# EAGLE design control_AX12 (EAGLE 6.1)
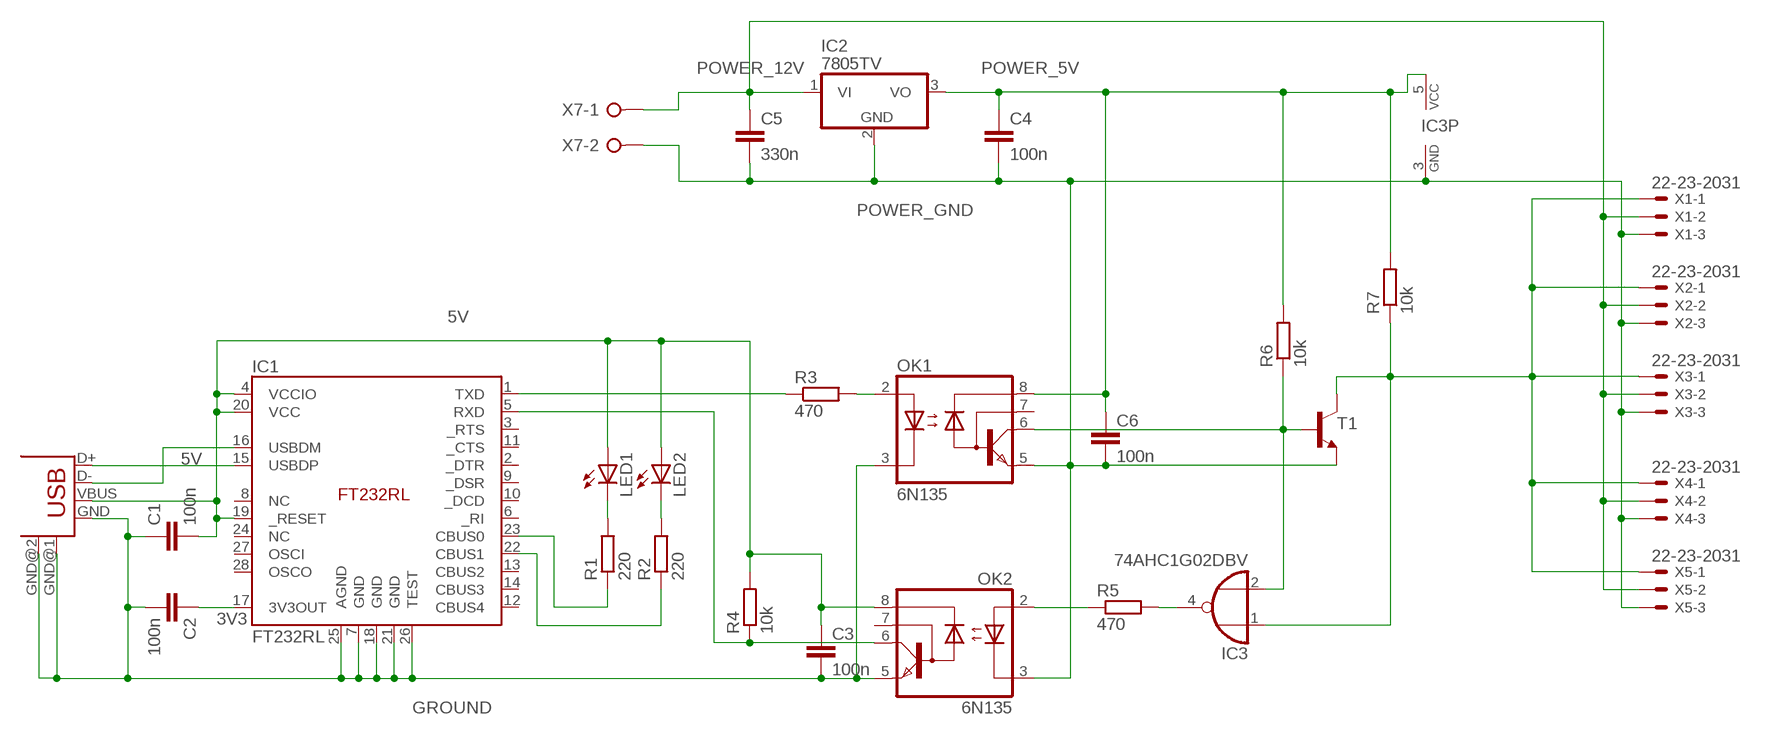
[diagram p0: schematic, sheet 1]

## Parts
C1  100n  C-EUC0805  [C0805]
C2  100n  C-EUC0805  [C0805]
C3  100n  C-EUC0805  [C0805]
C4  100n  C-EUC0805  [C0805]
C5  330n  C-EUC0805  [C0805]
C6  100n  C-EUC0805  [C0805]
IC1  FT232RL  [SSOP-28]
IC2  7805TV  [TO220V]
IC3  74AHC1G02DBV  [SOT23-5]
LED1  LED5MM  [LED5MM]
LED2  LED5MM  [LED5MM]
OK1  6N135  [DIL08]
OK2  6N135  [DIL08]
R1  220  R-EU_M0805  [M0805]
R2  220  R-EU_M0805  [M0805]
R3  470  R-EU_0207/10  [0207/10]
R4  10k  R-EU_0207/10  [0207/10]
R5  470  R-EU_0207/10  [0207/10]
R6  10k  R-EU_0207/10  [0207/10]
R7  10k  R-EU_0207/10  [0207/10]
T1  BC547-NPN-TO92-CBE  [TO92-CBE]
USB1  USB-B-H  [USB-B-H]
X1  22-23-2031  [22-23-2031]
X2  22-23-2031  [22-23-2031]
X3  22-23-2031  [22-23-2031]
X4  22-23-2031  [22-23-2031]
X5  22-23-2031  [22-23-2031]
X7  W237-02P  [W237-132]

## Nets
3V3: C2.1 IC1.17(3V3OUT)
5V: C1.2 C3.1 IC1.4(VCCIO) IC1.19(_RESET) IC1.20(VCC) LED1.A LED2.A OK2.8(VCC) R4.2 USB1.VBUS
GROUND: C1.1 C2.2 C3.2 IC1.7(GND) IC1.18(GND) IC1.21(GND) IC1.25(AGND) IC1.26(TEST) OK1.3(C) OK2.5(GND) USB1.GND USB1.GND@1(GND) USB1.GND@2(GND)
N$5: IC1.22(CBUS1) R2.1
N$6: IC1.1(TXD) R3.1
N$7: IC1.5(RXD) OK2.6(VO) R4.1
N$8: IC1.23(CBUS0) R1.1
N$9: LED1.K(C) R1.2
N$10: LED2.K(C) R2.2
N$20: OK1.2(A) R3.2
N$33: IC1.16(USBDM) USB1.D-
N$42: IC1.15(USBDP) USB1.D+
N$43: OK2.2(A) R5.1
N$44: IC3.4(O) R5.2
N$46: IC3.2(I1) OK1.6(VO) R6.1 T1.B
N$49: IC3.1(I0) R7.1 T1.C X1.1 X2.1 X3.1 X4.1 X5.1
POWER_5V: C4.1 C6.1 IC2.3(VO) IC3.5(VCC) OK1.8(VCC) R6.2 R7.2
POWER_12V: C5.1 IC2.1(VI) X1.2 X2.2 X3.2 X4.2 X5.2 X7.1
POWER_GND: C4.2 C5.2 C6.2 IC2.2(GND) IC3.3(GND) OK1.5(GND) OK2.3(C) T1.E X1.3 X2.3 X3.3 X4.3 X5.3 X7.2
Unconnected: IC1.2(_DTR) IC1.3(_RTS) IC1.6(_RI) IC1.8(NC) IC1.9(_DSR) IC1.10(_DCD) IC1.11(_CTS) IC1.12(CBUS4) IC1.13(CBUS2) IC1.14(CBUS3) IC1.24(NC) IC1.27(OSCI) IC1.28(OSCO) OK1.7(VB) OK2.7(VB)

## Library data of the parts
C1-C6 = rcl:C-EU: CAPACITOR, European symbol
IC1 = ftdi4:FT232RL
IC2 = linear:78*: Positive VOLTAGE REGULATOR Source: http://cache.national.com/ds/LM/LM78L05.pdf http://www.fairchildsemi.com/ds/LM/LM7805.pdf
IC3 = 74xx-little-de:74*1G02: 2-input NOR gate
LED1 LED2 = led:LED: LED OSRAM: - CHIPLED LG R971, LG N971, LY N971, LG Q971, LY Q971, LO R971, LY R971 LH N974, LH R974 LS Q976, LO Q976, LY Q976 LO Q996 - Hyper CHIPLED LW Q18S LB Q993, LB Q99A, LB R99A - SideLED LS A670, LO A670, LY A670, LG A670, LP A670 LB A673, LV A673, LT A673, LW A673 LH A674 LY A675 LS A676, LA A676, LO A676, LY A676, LW A676 LS A679, LY A679, LG A679 - Hyper Micro SIDELED® LS Y876, LA Y876, LO Y876, LY Y876 LT Y87S - SmartLED LW L88C, LW L88S LB L89C, LB L89S, LG L890 LS L89K, LO L89K, LY L89K LS L896, LA L896, LO L896, LY L896 - TOPLED LS T670, LO T670, LY T670, LG T670, LP T670 LSG T670, LSP T670, LSY T670, LOP T670, LYG T670 LG T671, LOG T671, LSG T671 LB T673, LV T673, LT T673, LW T673 LH T674 LS T676, LA T676, LO T676, LY T676, LB T676, LH T676, LSB T676, LW T676 LB T67C, LV T67C, LT T67C, LS T67K, LO T67K, LY T67K, LW E67C LS E67B, LA E67B, LO E67B, LY E67B, LB E67C, LV E67C, LT E67C LW T67C LS T679, LY T679, LG T679 LS T770, LO T770, LY T770, LG T770, LP T770 LB T773, LV T773, LT T773, LW T773 LH T774 LS E675, LA E675, LY E675, LS T675 LS T776, LA T776, LO T776, LY T776, LB T776 LHGB T686 LT T68C, LB T68C - Hyper Mini TOPLED® LB M676 - Mini TOPLED Santana® LG M470 LS M47K, LO M47K, LY M47K Source: http://www.osram.convergy.de LUXEON: - LUMILED® LXK2-PW12-R00, LXK2-PW12-S00, LXK2-PW14-U00, LXK2-PW14-V00 LXK2-PM12-R00, LXK2-PM12-S00, LXK2-PM14-U00 LXK2-PE12-Q00, LXK2-PE12-R00, LXK2-PE12-S00, LXK2-PE14-T00, LXK2-PE14-U00 LXK2-PB12-K00, LXK2-PB12-L00, LXK2-PB12-M00, LXK2-PB14-N00, LXK2-PB14-P00, LXK2-PB14-Q00 LXK2-PR12-L00, LXK2-PR12-M00, LXK2-PR14-Q00, LXK2-PR14-R00 LXK2-PD12-Q00, LXK2-PD12-R00, LXK2-PD12-S00 LXK2-PH12-R00, LXK2-PH12-S00 LXK2-PL12-P00, LXK2-PL12-Q00, LXK2-PL12-R00 Source: www.luxeon.com KINGBRIGHT: KA-3528ASYC Source: www.kingbright.com
OK1 OK2 = optocoupler:6N135: MOTOROLA OPTO COUPLER; MF: FAIRCHILD SEMICONDUCTOR; MPN: 6N135; OC_FARNELL: 1021342; OC_NEWARK: 58K9658
R1 R2 = resistor:R-EU_: RESISTOR, European symbol
R3-R7 = rcl:R-EU_: RESISTOR, European symbol
T1 = transistor:*-NPN-: NPN Transistror BF959 corrected 2008.03.06
USB1 = con-usb-2:USB: USB Connectors
X1-X5 = con-molex:22-23-2031: .100" (2.54mm) Center Header - 3 Pin; MF: MOLEX; MPN: 22-23-2031; OC_FARNELL: 1462950; OC_NEWARK: 30C0862
X7 = con-wago-508:W237-02P: WAGO SREW CLAMP; OC_FARNELL: unknown; OC_NEWARK: unknown

## Board
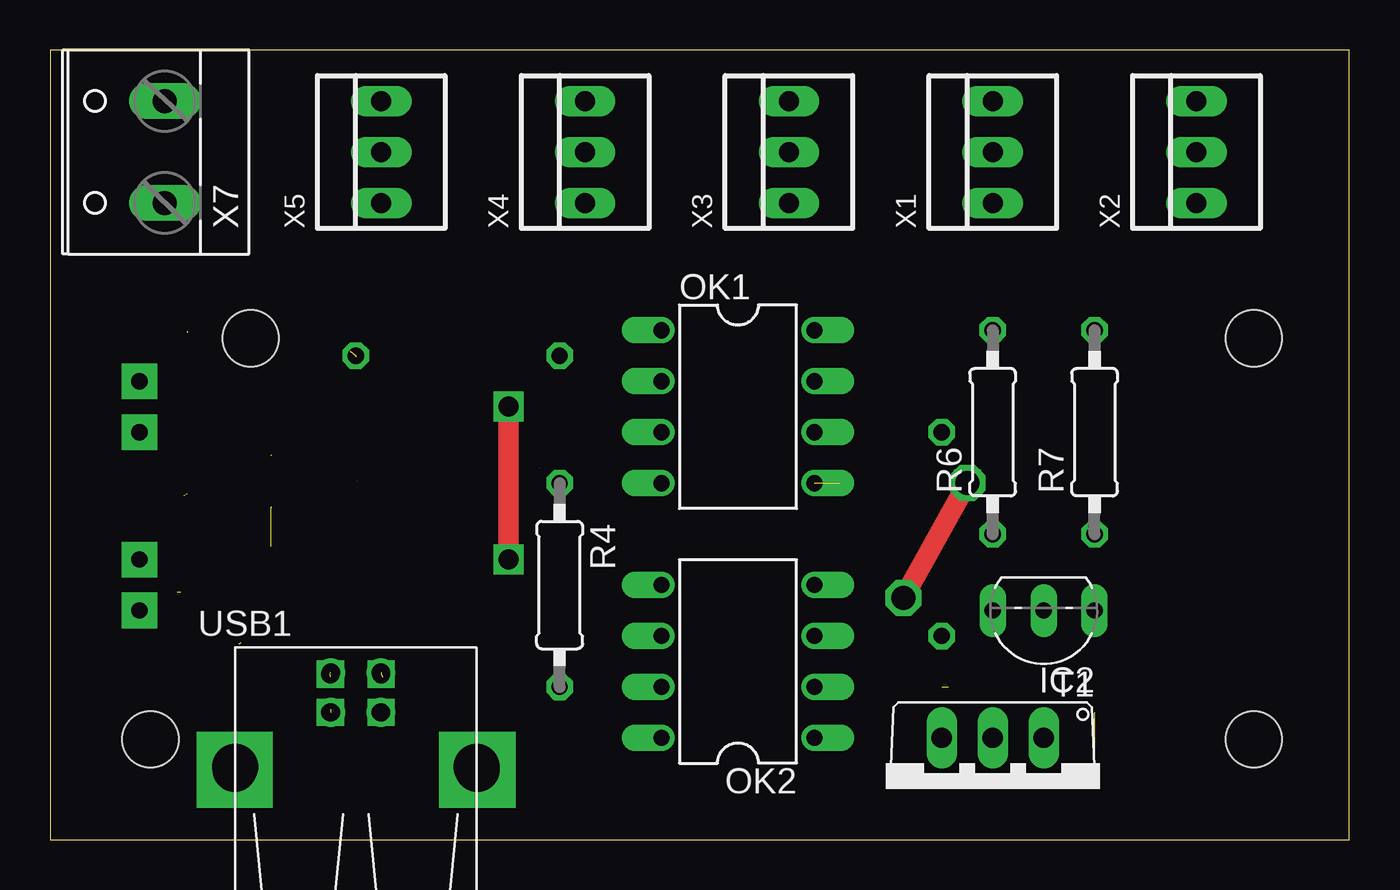
[diagram p1: board, top side]
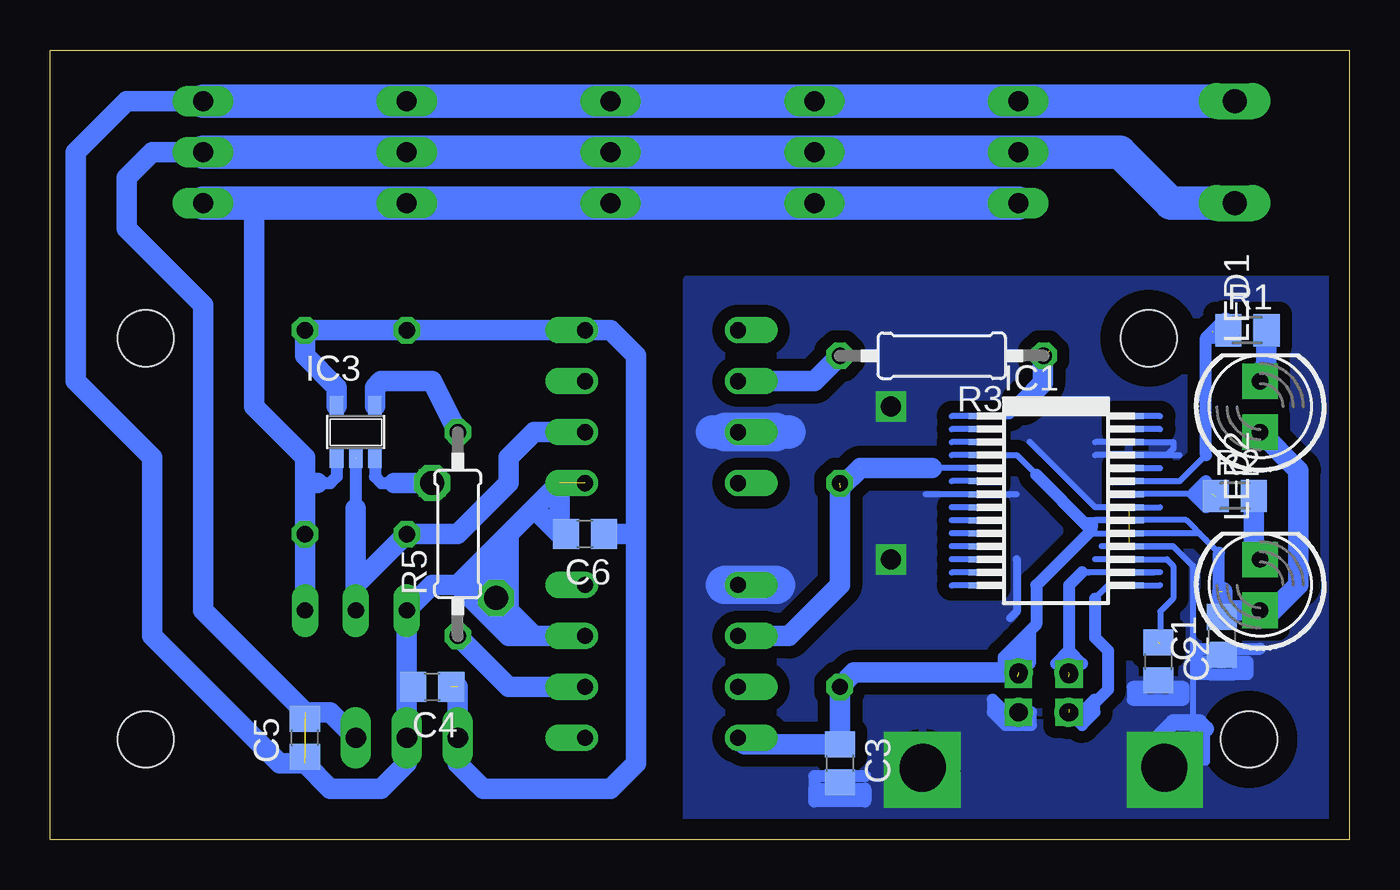
[diagram p2: board, bottom side, seen from below]

Size 64.77 x 39.37 mm. Coordinates in mm from the lower left corner, seen from the top.
Outline: 0,0 64.77,0 64.77,39.37 0,39.37 0,0
Copper layers (1*16): Top 0.035mm / dielectric 1.5mm / Bottom 0.035mm
Design rules: minimum track width 10mil, minimum drill 24mil, track to track 8mil, track to pad 8mil, pad to pad 8mil, via to via 8mil, smd to smd 8mil, copper to edge 40mil, drill to drill 8mil, minimum pad ring 10mil, minimum via ring 8mil, stop-mask expansion 4mil, vias tented up to drill 0mil, thermal gap 10mil
Holes 2.8 mm at 5,5 60,5 60,25 10,25

### Footprints (pad centres in the part's own frame; a part is rotated, then mirrored left to right if it is on the bottom)
C0805 = smd 1.3 x 1.5: 1 -0.95,0; 2 0.95,0
SSOP-28 = smd 0.3 x 1.5: 1 -4.225,-3.625; 2 -3.575,-3.625; 3 -2.925,-3.625; 4 -2.275,-3.625; 5 -1.625,-3.625; 6 -0.975,-3.625; 7 -0.325,-3.625; 8 0.325,-3.625; 9 0.975,-3.625; 10 1.625,-3.625; 11 2.275,-3.625; 12 2.925,-3.625; 13 3.575,-3.625; 14 4.225,-3.625; 15 4.225,3.625; 16 3.575,3.625; 17 2.925,3.625; 18 2.275,3.625; 19 1.625,3.625; 20 0.975,3.625; 21 0.325,3.625; 22 -0.325,3.625; 23 -0.975,3.625; 24 -1.625,3.625; 25 -2.275,3.625; 26 -2.925,3.625; 27 -3.575,3.625; 28 -4.225,3.625
TO220V = drill 1.016 long: 1 -2.54,-2.54; 2 0,-2.54; 3 2.54,-2.54
SOT23-5 = smd 0.69 x 0.99: 1 -0.95,-1.29; 2 0,-1.29; 3 0.95,-1.29; 4 0.95,1.3; 5 -0.95,1.3
LED5MM = drill 0.813 octagon: A -1.27,0; K 1.27,0
DIL08 = drill 0.813 offset: 1 -3.81,-3.81; 2 -1.27,-3.81; 3 1.27,-3.81; 4 3.81,-3.81; 5 3.81,3.81; 6 1.27,3.81; 7 -1.27,3.81; 8 -3.81,3.81
M0805 = smd 1.3 x 1.6: 1 -0.95,0; 2 0.95,0
0207/10 = drill 0.813 octagon: 1 -5.08,0; 2 5.08,0
TO92-CBE = drill 0.813 long: B 0,0; C -2.54,0; E 2.54,0
USB-B-H = drill 0.914: D+ 0,1.25; D- 1.981,1.25; GND 0,-1.25; VBUS 1.981,-1.25 | drill 2.286: GND@1 -2.718,6.02; GND@2 -2.718,-6.02
22-23-2031 = drill 1 long: 1 -2.54,0; 2 0,0; 3 2.54,0
W237-132 = drill 1.194 long: 1 -2.54,-0.635; 2 2.54,-0.635

### Placement (x,y rotation side)
C1  6.35,10.16 90 bottom
C2  9.53,8.89 270 bottom
C3  25.4,3.81 270 bottom
C4  45.72,7.62 180 bottom
C5  52.07,5.08 90 bottom
C6  38.1,15.24 180 bottom
IC1  14.62,16.9 270 bottom
IC2  46.99,2.54 180 top
IC3  49.53,20.32 0 bottom
LED1  4.45,21.59 90 bottom
LED2  4.45,12.7 90 bottom
OK1  34.29,21.59 270 top
OK2  34.29,8.89 90 top
R1  5.08,25.4 0 bottom
R2  5.71,17.14 0 bottom
R3  20.32,24.13 180 bottom
R4  25.4,12.7 270 top
R5  44.45,15.24 90 bottom
R6  46.99,20.32 90 top
R7  52.07,20.32 90 top
T1  49.53,11.43 180 top
USB1  15.24,6.35 90 top
X1  46.99,34.29 90 top
X2  57.15,34.29 90 top
X3  36.83,34.29 90 top
X4  26.67,34.29 90 top
X5  16.51,34.29 90 top
X7  5.08,34.29 90 top

### Tracks (layer width: path | path; a pad name or v marks a point on that pad's centre or on a via)
3V3  (1 unrouted)
  Bottom 0.305: IC1.17 9.1,13.97 8.78,13.65 8.78,12.03 9.43,11.38 9.43,9.75
5V  (via drill 0.9 pad 0.25)  (4 unrouted)
  Bottom 0.305: IC1.4 16.57,19.18 15.28,17.88 | 11.01,15.28 7.48,15.28 6.5,14.3 | 12.68,15.28 13.01,15.61 | 13.01,15.61 15.28,17.88 | 12.68,15.28 | 12.68,15.28 13.01,15.28 | 16.58,9.75 16.58,8.45 | 7.15,14.96 | 7.15,14.96 8.13,15.93 12.68,15.93 | 13.33,15.93 13.01,15.93 | 13.01,15.93 12.68,15.93 | 12.68,15.28 12.68,15.61 | 12.68,15.61 13,15.93 | 13,15.93 IC1.20 12.67,15.93 12.68,15.93 | 13,15.93 13.01,15.93 | 13.01,15.93 13.01,15.61 | 13.01,15.61 13.01,15.28 | 13.01,15.28 12.68,15.28 | 12.68,15.93 12.68,15.61 | 12.68,15.28 11.01,15.28 | 11.01,15.28 IC1.19
  Bottom 0.61: 6.5,12.36 6.5,14.3 | 13.01,15.28 15.61,12.68 15.61,10.73 16.26,10.08 | 16.26,10.08 16.58,9.75 | 16.58,9.75 16.58,8.13 | 16.26,10.08 | 16.26,10.08 15.93,10.4 15.93,8.78 16.26,8.78 | 16.26,8.78 17.23,8.78 17.23,9.1 16.58,9.75 | 16.58,9.75 16.26,9.75 16.26,8.78 | 13.01,15.61 15.61,18.21
  Bottom 1.016: LED2.A 4.6,11.43 | C1.2 6.33,12.36 6.33,11.46 6.35,11.43 LED2.A | LED2.A 3.81,11.43 2.54,12.7 2.54,18.41 LED1.A | USB1.VBUS 24.69,8.33 R4.2 C3.1 30.16,4.76 OK2.8
  other vias: 16.51,8.26
GROUND  (via drill 0.9 pad 0.25, 1 pad 0.25, 2.2 pad 3.81)  (3 unrouted)
  Top 1.016: v22.86,13.97 v22.86,21.59
  Bottom 0.305: IC1.25 12.68,19.18 | 12.68,19.18 | IC1.26 12.68,19.82 | 12.68,19.82 | 10.72,19.82 8.78,19.82 8.78,19.5 9.1,19.18 10.72,19.18 | 16.57,17.23 16.91,17.23 | 16.91,17.23 21.12,17.23 | 11.05,19.18 8.45,19.18 | 12.67,16.57 IC1.21 12.67,16.57 | 11.05,16.57 9.43,16.57 | 12.67,16.57 15.93,19.83 | 8.78,14.63 12.36,14.63 12.35,14.62 IC1.18 8.78,14.62 8.78,14.63 | 8.78,14.63 7.8,13.65 7.8,3.9 8.13,3.58 9.1,3.58 | IC1.7 16.91,17.23 | 16.91,17.23
  Bottom 0.406: 7.15,5.53 7.15,3.9 v9.2,3.48 | 16.58,13.98 16.58,11.38 16.91,11.05
  Bottom 0.61: v16.51,6.35 17.14,6.35 17.78,6.99 17.78,6.35 17.14,5.71 15.88,5.71 15.88,6.35 | 10.16,7.62 10.79,7.62 10.79,6.99 | 8.89,6.99 8.26,6.99 8.26,7.62 | 8.26,7.62 10.16,7.62 | 10.16,7.62 10.79,6.99 | 10.79,6.99 8.89,6.99 | 8.89,6.99 8.26,7.62 | 26.67,2.54 26.67,3.17 24.13,3.17 | 26.67,2.54 24.13,2.54 24.13,1.91 26.67,1.91 26.67,2.54 | 7.62,8.89 7.62,9.53 4.45,9.53 | 7.62,8.89 5.08,8.89 | 5.08,8.89 5.08,8.26 5.71,8.26 | 6.99,8.26 7.62,8.26 7.62,8.89 | 7.62,8.89 6.99,8.26 | 6.99,8.26 5.71,8.26 | 5.71,8.26 5.08,8.89
  Bottom 0.813: 7.15,5.53 7.47,5.85 8.78,5.85 9.75,4.88 9.75,3.58
  Bottom 1.676: 31.75,20.32 31.11,20.32 29.84,20.32 | 28.57,20.32 27.94,20.32
  Bottom 1.93: 28.57,12.7 OK2.5 31.11,12.7 | 29.84,20.32 28.57,20.32 | 29.21,20.32 31.11,20.32
  other vias: 21.3,3.48
  pour Bottom (isolate 0.61): 0,0 33.02,0 33.02,27.94 0,27.94
N$1
  Bottom 0.305: 9.43,13.33 10.73,13.33
N$2
  Bottom 0.305: 10.72,12.68 9.75,12.68
N$5  (1 unrouted)
  Bottom 0.305: 6.83,17.23 7.8,17.23 10.99,17.23 IC1.22
  Bottom 0.61: 6.5,17.23 7.48,17.23 | 7.8,17.23 7.48,17.23 | 7.48,17.23 7.15,17.56 | 7.15,17.56 7.15,16.58 7.8,17.23 | 7.8,17.23 7.15,17.88 7.15,17.56
N$6  (2 unrouted)
  Bottom 0.305: IC1.1 16.9,21.12 14.95,23.07 14.95,24.37
  Bottom 1.016: 15.28,24.06 15.28,22.76 16.26,21.78
N$7  (2 unrouted)
  Bottom 0.305: IC1.5 24.37,18.52 25.35,17.55
  Bottom 1.016: R4.1 25.4,12.7 27.94,10.16 OK2.6 | 25.36,17.56 24.38,18.53 20.81,18.53
N$8  (1 unrouted)
  Bottom 0.305: IC1.23 8.46,17.88 7.15,19.18 | 6.83,25.3 6.13,25.3 R1.1
  Bottom 0.61: 7.15,19.18 7.15,25.03 | 7.15,25.03 6.83,25.36 6.18,25.36 | 6.18,26.01 7.15,25.03 | 7.15,25.03 6.18,25.03
N$9
  Bottom 1.016: R1.2 4.13,23.81 LED1.K
N$10
  Bottom 1.016: R2.2 4.76,14.29 LED2.K
N$14
  Bottom 0.305: 10.73,12.68 9.43,12.68
N$15
  Bottom 0.305: 18.2,12.68 19.82,12.68
N$17
  Bottom 0.305: 18.2,13.32 19.82,13.32
N$19
  Bottom 0.305: 18.52,13.97 19.82,13.97
N$20
  Bottom 1.016: OK1.2 26.67,22.86 R3.2
N$22
  Bottom 0.305: 18.52,14.62 19.82,14.62
N$24
  Bottom 0.305: 18.52,15.28 19.82,15.28
N$25
  Bottom 0.305: 9.43,20.48 11.05,20.48
N$26
  Bottom 0.305: 9.43,21.12 10.72,21.12
N$27
  Bottom 0.305: 18.52,15.93 19.82,15.93
N$28
  Bottom 0.305: 18.85,16.57 19.82,16.57
N$29
  Bottom 0.305: 18.85,17.88 19.82,17.88
N$30
  Bottom 0.305: 18.85,19.18 19.82,19.18
N$31
  Bottom 0.305: 18.85,19.82 19.82,19.82
N$32
  Bottom 0.305: 18.85,20.48 19.82,20.48
N$33  (via drill 0.9 pad 0.25)  (2 unrouted)
  Bottom 0.305: IC1.16 13,13.32 13.01,13.33 13.33,13.33 | 13.33,13.33 | 13.33,13.33 13.98,12.68
  Bottom 0.61: 13.98,12.68 13.98,9.43 | 13.98,9.43 13.98,8.13 | 13.98,12.68 | 13.98,12.68 13.33,13.33 | 13.33,8.78 13.98,9.43 | 13.98,9.43 14.63,8.78
  other vias: 13.97,8.26
N$35
  Bottom 0.305: 10.4,13.32 9.75,13.32
N$36
  Bottom 0.305: 11.05,13.98 12.68,13.98
N$37  (via drill 0.8 pad 1.78)
  other vias: 4.45,13.97
N$38  (via drill 0.8 pad 1.78)
  other vias: 4.45,11.43
N$39  (via drill 0.8 pad 1.78)
  other vias: 4.45,22.86
N$40  (via drill 0.8 pad 1.78)
  other vias: 4.45,20.32
N$41
  Bottom 0.305: 10.72,18.52 9.43,18.52
N$42  (via drill 0.9 pad 0.25)  (1 unrouted)
  Bottom 0.305: IC1.15 12.03,12.68 12.68,12.03 12.68,10.08 | 12.68,10.08 | 12.68,10.08 12.03,9.43
  Bottom 0.61: 12.68,12.03 12.68,10.08 12.03,9.43 12.03,7.48 13.01,6.5 13.98,6.5 | USB1.D+ v13.97,6.35 13.34,5.71 12.7,6.35 12.7,6.99 13.34,6.35
N$43
  Bottom 1.016: OK2.2 41.91,7.62 R5.1
N$44
  Bottom 1.016: R5.2 45.72,22.86 48.26,22.86 48.58,22.54 IC3.4
N$45
  Bottom 0.305: 18.2,21.12 19.82,21.12
N$46
  Bottom 0.305: 49.53,16.51 49.53,12.7
  Bottom 0.61: IC3.2 49.53,16.51
  Bottom 1.016: OK1.6 40.64,20.32 41.91,19.05 41.91,17.78 44.45,15.24 R6.1 49.53,12.7 T1.B 49.53,16.51
N$47
  Bottom 1.016: 4.23,11.05 4.23,11.38 4.55,11.7
N$49
  Bottom 0.61: 51.44,17.78 50.8,17.78 50.48,18.1 IC3.1
  Bottom 1.016: T1.C R7.1 52.07,17.78 | 52.07,17.78 52.07,19.05 54.61,21.59 54.61,31.75 | 52.07,17.78 51.44,17.78
  Bottom 1.676: X5.1 X4.1 X3.1 X1.1 54.61,31.75 X2.1
POWER_5V  (1 unrouted)
  Bottom 1.016: 35.56,15.24 35.56,24.13 36.83,25.4 OK1.8 R6.2 R7.2 52.07,24.13 50.48,22.54 IC3.5 | 35.56,15.24 35.56,3.81 36.83,2.54 43.18,2.54 44.45,3.81 IC2.3 | C6.1 35.56,15.24 | 44.45,6.35 IC2.3 | IC2.3 44.45,7.62
POWER_12V  (1 unrouted)
  Bottom 1.016: X2.2 59.69,34.29 60.96,33.02 60.96,30.48 57.15,26.67 57.15,11.43 52.07,6.35 50.8,6.35 IC2.1
  Bottom 1.676: X7.1 8.89,31.75 11.43,34.29 X5.2 X4.2 X3.2 X1.2 X2.2
POWER_GND  (via drill 0.9 pad 0.25, 1.2 pad 0.25)  (2 unrouted)
  Top 1.016: v42.55,12.06 v45.72,17.78
  Bottom 0.61: 47.62,17.78 48.26,17.78 48.58,18.1 IC3.3
  Bottom 1.016: C6.2 39.37,15.24 | 40.64,16.51 39.37,17.78 39.37,15.24 | 39.37,15.24 40.64,16.51 | 46.99,7.62 T1.E 45.72,12.7 44.45,12.7 | 40.64,16.51 41.91,15.24 | 41.91,15.24 v42.55,12.06 | v42.55,12.06 44.45,12.7 | OK2.3 40.64,10.16 | 40.64,10.16 41.91,10.16 | v42.55,12.06 41.91,11.43 | 41.91,11.43 41.91,12.7 | 41.91,15.24 41.91,12.7 | 41.91,12.7 43.18,12.7 | 44.45,12.7 43.18,13.97 | 43.18,13.97 41.91,15.24 | X2.3 60.96,36.83 63.5,34.29 63.5,22.86 59.69,19.05 59.69,10.16 53.34,3.81 52.07,3.81 50.8,2.54 48.26,2.54 46.99,3.81 IC2.2 46.99,7.62 | 41.91,10.16 44.45,12.7 | 44.45,12.7 43.18,12.7 | 43.18,13.97 43.18,12.7 | 40.64,10.16 41.91,11.43 | 41.91,11.43 41.91,10.16 | C4.2 46.99,7.62 | v45.72,17.78 47.62,17.78
  Bottom 1.676: X7.2 X5.3 X4.3 X3.3 X1.3 X2.3